# Altium schematic sheet ANA_FE_CLK_SYNTH.SchDoc: My title
size A3; Organization: University of California; Address1: 475 Portola Plaza; Address2: Los Angeles, CA 90095; Revision: R01; SheetNumber: 1; SheetTotal: 1
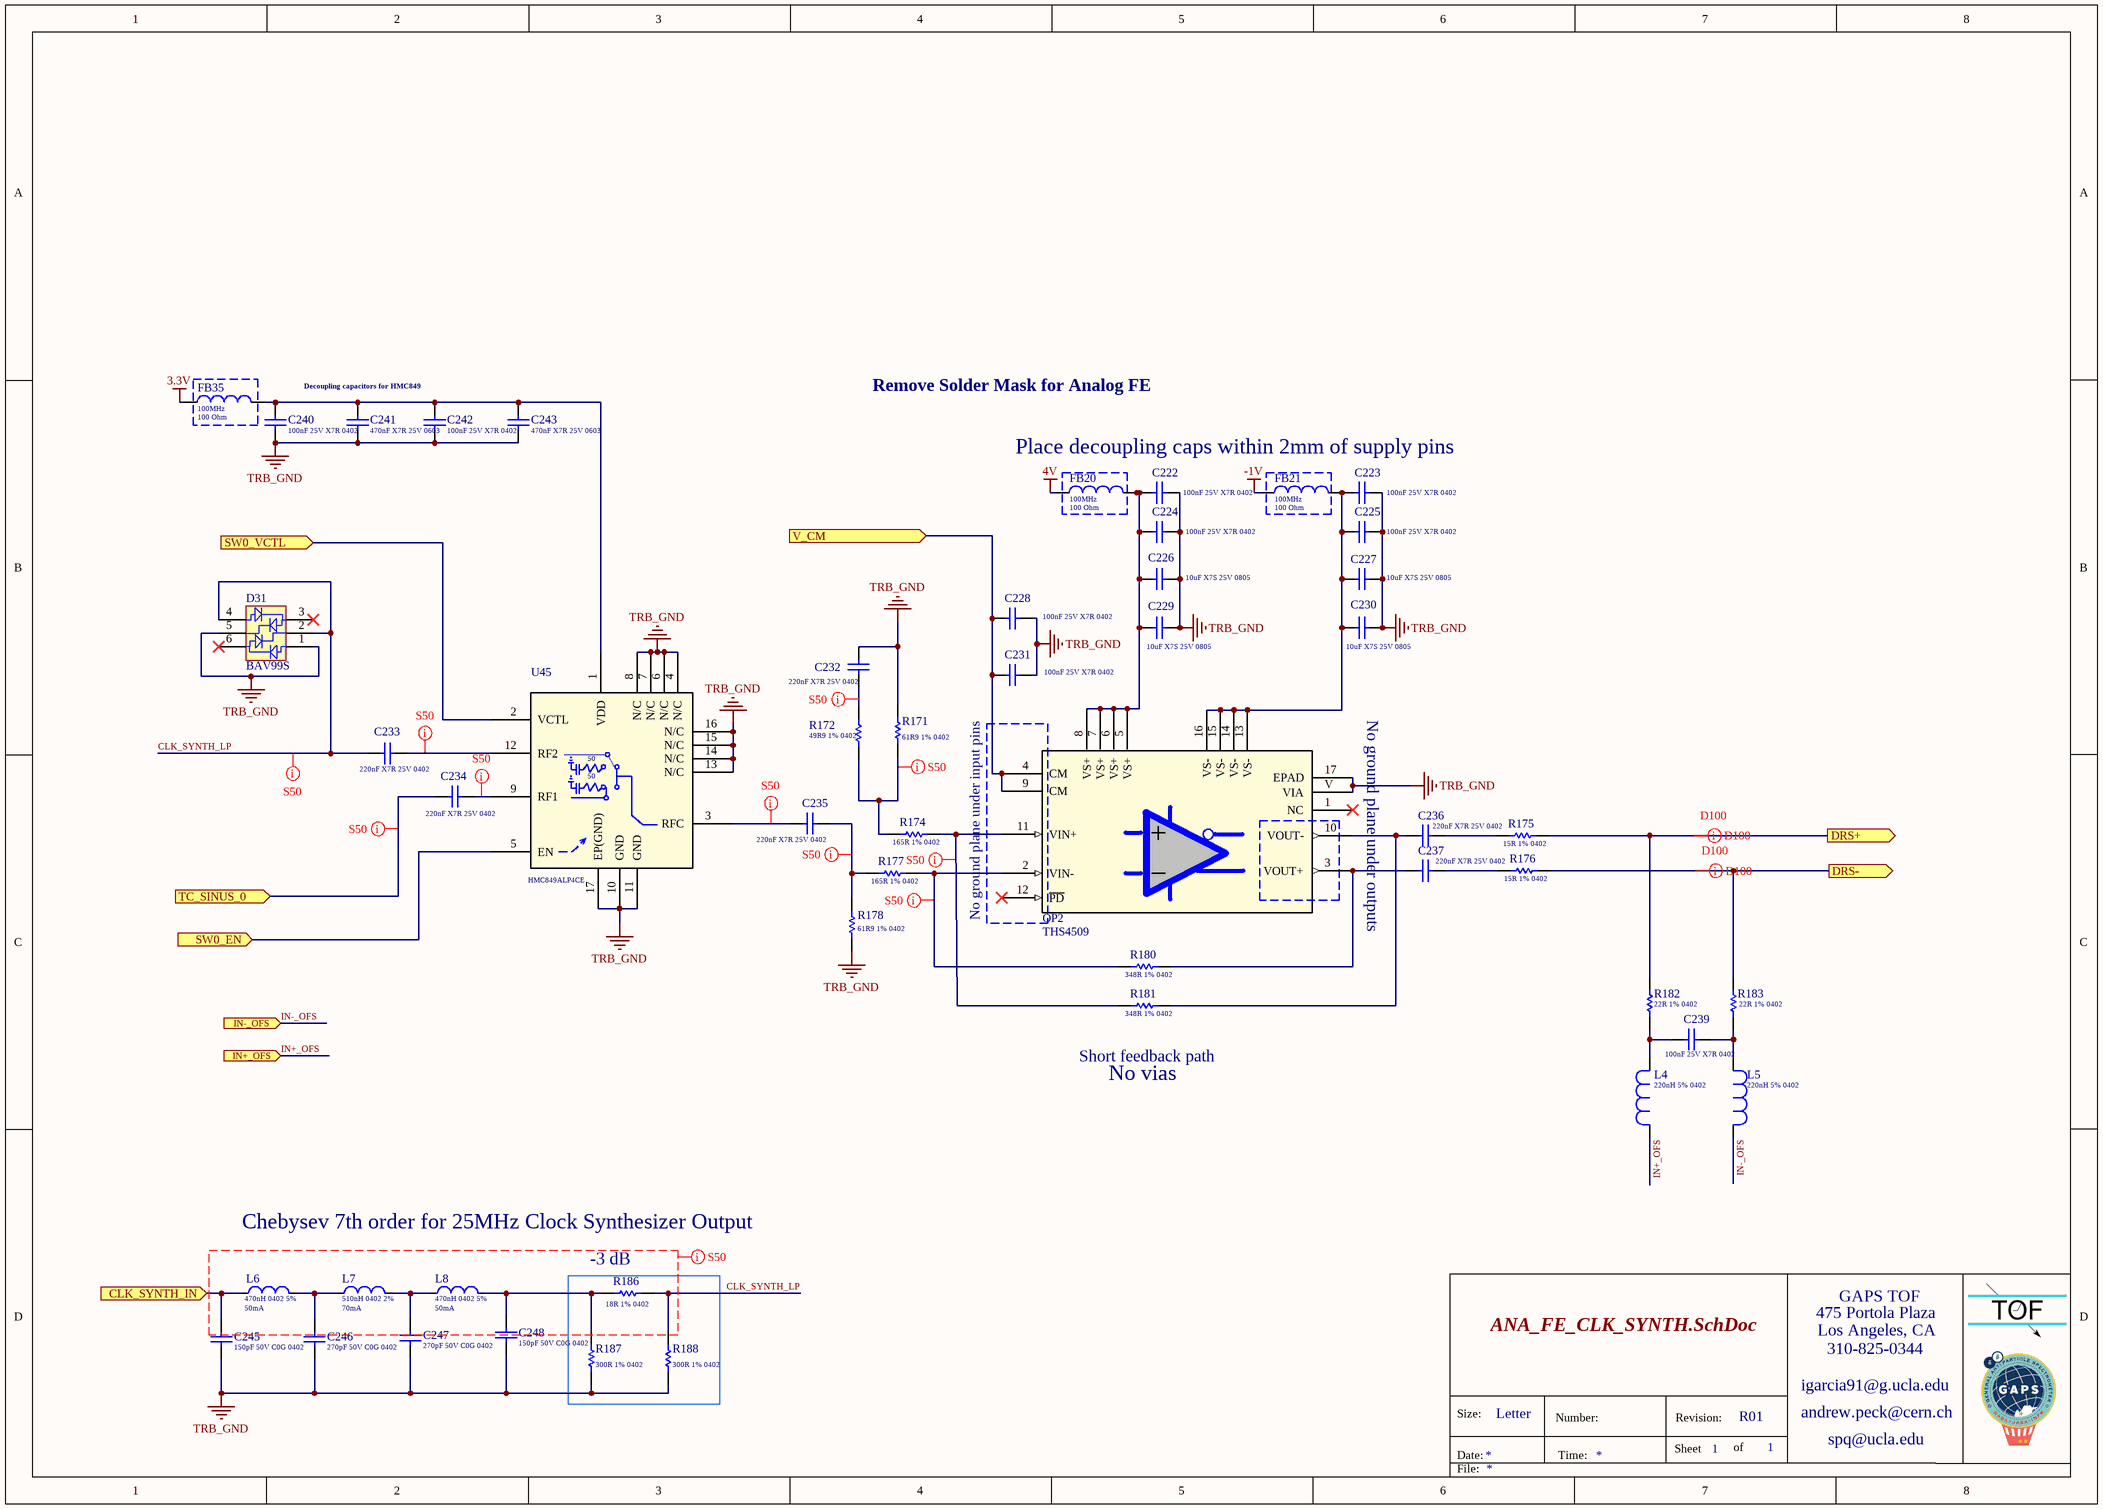
[diagram p0: ANA_FE_CLK_SYNTH.SchDoc]

## Parts
C222  Capacitance: 100nF 25V X7R 0402  [Cap_Taiyo_Yuden_TMK105B7104KV-FR_100nF]  (hidden comment: Cap_Taiyo_Yuden_TMK105B7104KV-FR_100nF)
C223  Capacitance: 100nF 25V X7R 0402  [Cap_Taiyo_Yuden_TMK105B7104KV-FR_100nF]  (hidden comment: Cap_Taiyo_Yuden_TMK105B7104KV-FR_100nF)
C224  Capacitance: 100nF 25V X7R 0402  [Cap_Taiyo_Yuden_TMK105B7104KV-FR_100nF]  (hidden comment: Cap_Taiyo_Yuden_TMK105B7104KV-FR_100nF)
C225  Capacitance: 100nF 25V X7R 0402  [Cap_Taiyo_Yuden_TMK105B7104KV-FR_100nF]  (hidden comment: Cap_Taiyo_Yuden_TMK105B7104KV-FR_100nF)
C226  Capacitance: 10uF X7S 25V 0805  [Cap_Murata_ GRM21BC71E106ME11L_10uF]  (hidden comment: Cap_Murata_ GRM21BC71E106ME11L_10uF)
C227  Capacitance: 10uF X7S 25V 0805  [Cap_Murata_ GRM21BC71E106ME11L_10uF]  (hidden comment: Cap_Murata_ GRM21BC71E106ME11L_10uF)
C228  Capacitance: 100nF 25V X7R 0402  [Cap_Taiyo_Yuden_TMK105B7104KV-FR_100nF]  (hidden comment: Cap_Taiyo_Yuden_TMK105B7104KV-FR_100nF)
C229  Capacitance: 10uF X7S 25V 0805  [Cap_Murata_ GRM21BC71E106ME11L_10uF]  (hidden comment: Cap_Murata_ GRM21BC71E106ME11L_10uF)
C230  Capacitance: 10uF X7S 25V 0805  [Cap_Murata_ GRM21BC71E106ME11L_10uF]  (hidden comment: Cap_Murata_ GRM21BC71E106ME11L_10uF)
C231  Capacitance: 100nF 25V X7R 0402  [Cap_Taiyo_Yuden_TMK105B7104KV-FR_100nF]  (hidden comment: Cap_Taiyo_Yuden_TMK105B7104KV-FR_100nF)
C232  Capacitance: 220nF X7R 25V 0402  [Cap_TDK_C1608X5R1A106M080AC_220nF]  (hidden comment: Cap_TDK_C1608X5R1A106M080AC_220nF)
C233  Capacitance: 220nF X7R 25V 0402  [Cap_TDK_C1608X5R1A106M080AC_220nF]  (hidden comment: Cap_TDK_C1608X5R1A106M080AC_220nF)
C234  Capacitance: 220nF X7R 25V 0402  [Cap_TDK_C1608X5R1A106M080AC_220nF]  (hidden comment: Cap_TDK_C1608X5R1A106M080AC_220nF)
C235  Capacitance: 220nF X7R 25V 0402  [Cap_TDK_C1608X5R1A106M080AC_220nF]  (hidden comment: Cap_TDK_C1608X5R1A106M080AC_220nF)
C236  Capacitance: 220nF X7R 25V 0402  [Cap_TDK_C1608X5R1A106M080AC_220nF]  (hidden comment: Cap_TDK_C1608X5R1A106M080AC_220nF)
C237  Capacitance: 220nF X7R 25V 0402  [Cap_TDK_C1608X5R1A106M080AC_220nF]  (hidden comment: Cap_TDK_C1608X5R1A106M080AC_220nF)
C239  Capacitance: 100nF 25V X7R 0402  [Cap_Taiyo_Yuden_TMK105B7104KV-FR_100nF]  (hidden comment: Cap_Taiyo_Yuden_TMK105B7104KV-FR_100nF)
C240  Capacitance: 100nF 25V X7R 0402  [Cap_Taiyo_Yuden_TMK105B7104KV-FR_100nF]  (hidden comment: Cap_Taiyo_Yuden_TMK105B7104KV-FR_100nF)
C241  Capacitance: 470nF X7R 25V 0603  [Cap_Wurth_Electronics_885012206075_470nF]  (hidden comment: Cap_Wurth_Electronics_885012206075_470nF)
C242  Capacitance: 100nF 25V X7R 0402  [Cap_Taiyo_Yuden_TMK105B7104KV-FR_100nF]  (hidden comment: Cap_Taiyo_Yuden_TMK105B7104KV-FR_100nF)
C243  Capacitance: 470nF X7R 25V 0603  [Cap_Wurth_Electronics_885012206075_470nF]  (hidden comment: Cap_Wurth_Electronics_885012206075_470nF)
C245  Capacitance: 150pF 50V C0G 0402  [Cap_TDK_CGA2B2C0G2A151J050BE_150pF]  (hidden comment: Cap_TDK_CGA2B2C0G2A151J050BE_150pF)
C246  Capacitance: 270pF 50V C0G 0402  [Cap_Murata_GCM1555C1H271FA16D_270pF]  (hidden comment: Cap_Murata_GCM1555C1H271FA16D_270pF)
C247  Capacitance: 270pF 50V C0G 0402  [Cap_Murata_GCM1555C1H271FA16D_270pF]  (hidden comment: Cap_Murata_GCM1555C1H271FA16D_270pF)
C248  Capacitance: 150pF 50V C0G 0402  [Cap_TDK_CGA2B2C0G2A151J050BE_150pF]  (hidden comment: Cap_TDK_CGA2B2C0G2A151J050BE_150pF)
D31  BAV99S  [INF-SOT363_V]
FB20  Measuring Frequency: 100MHz  Impedance: 100 Ohm  [FB_Wurth_Electronics_742792731_100Ohms]  (hidden comment: 742792731)
FB21  Measuring Frequency: 100MHz  Impedance: 100 Ohm  [FB_Wurth_Electronics_742792731_100Ohms]  (hidden comment: 742792731)
FB35  Measuring Frequency: 100MHz  Impedance: 100 Ohm  [FB_Wurth_Electronics_742792731_100Ohms]  (hidden comment: 742792731)
L4  Inductance: 220nH 5% 0402  [Ind_TDK_ MLG1005SR22JT000_220nH]  (hidden comment: Ind_TDK_ MLG1005SR22JT000_220nH)
L5  Inductance: 220nH 5% 0402  [Ind_TDK_ MLG1005SR22JT000_220nH]  (hidden comment: Ind_TDK_ MLG1005SR22JT000_220nH)
L6  470nH 0402 5%  Current Rating: 50mA  [TDK_MLF1005GR47JT000_0]
L7  510nH 0402 2%  Current Rating: 70mA  [TDK_MHQ1005PR51GT000_0]
L8  470nH 0402 5%  Current Rating: 50mA  [TDK_MLF1005GR47JT000_0]
OP2  THS4509  [RGT16]
R171  61R9 1% 0402  [RESC0402(1005)_L]
R172  49R9 1% 0402  [RESC0402(1005)_L]
R174  165R 1% 0402  [RESC0402(1005)_L]
R175  15R 1% 0402  [RESC0402(1005)_L]
R176  15R 1% 0402  [RESC0402(1005)_L]
R177  165R 1% 0402  [RESC0402(1005)_L]
R178  61R9 1% 0402  [RESC0402(1005)_L]
R180  348R 1% 0402  [RESC0402(1005)_L]
R181  348R 1% 0402  [RESC0402(1005)_L]
R182  22R 1% 0402  [RESC0402(1005)_L]
R183  22R 1% 0402  [RESC0402(1005)_L]
R186  18R 1% 0402  [RESC0402(1005)_L]
R187  300R 1% 0402  [RESC0402(1005)_L]
R188  300R 1% 0402  [RESC0402(1005)_L]
U45  HMC849  [CP_16_40]  (value not drawn)

## Blocks framed on the sheet
-3 dB: R186-R188

## Ports
CLK_SYNTH_IN (in), DRS+ (out), DRS- (out), IN+_OFS (in), IN-_OFS (in), SW0_EN (in), SW0_VCTL (in), TC_SINUS_0 (in), V_CM (in)

## Nets
3.3V: FB35.1
4V: FB20.1
-1V: FB21.1
TRB_GND: C222.2 C223.2 C224.2 C225.2 C226.1 C227.1 C228.2 C229.1 C230.1 C231.2 C232.1 C240.1 C241.2 C242.1 C243.2 C245.1 C246.1 C247.1 C248.1 D31.1(A1) D31.5(K5) OP2.17(EPAD) OP2.V(VIA) R171.2 R178.1 R187.1 R188.1 U45.4(N/C) U45.6(N/C) U45.7(N/C) U45.8(N/C) U45.10(GND) U45.11(GND) U45.13(N/C) U45.14(N/C) U45.15(N/C) U45.16(N/C) U45.17(EP(GND))
CLK_SYNTH_IN: C245.2 L6.1 ; port CLK_SYNTH_IN
CLK_SYNTH_LP: C233.2 D31.2(K2) D31.4(A4) R186.2 R188.2
DRS+: R175.2 R182.2 ; port DRS+
DRS-: R176.2 R183.2 ; port DRS-
IN+_OFS: L4.2 ; port IN+_OFS
IN-_OFS: L5.1 ; port IN-_OFS
SW0_EN: U45.5(EN) ; port SW0_EN
SW0_VCTL: U45.2(VCTL) ; port SW0_VCTL
TC_SINUS_0: C234.2 ; port TC_SINUS_0
V_CM: C228.1 C231.1 OP2.4(CM) OP2.9(CM) ; port V_CM
NetC222_1: C222.1 C224.1 C226.2 C229.2 FB20.2 OP2.5(VS+) OP2.6(VS+) OP2.7(VS+) OP2.8(VS+)
NetC223_1: C223.1 C225.1 C227.2 C230.2 FB21.2 OP2.13(VS-) OP2.14(VS-) OP2.15(VS-) OP2.16(VS-)
NetC232_2: C232.2 R172.2
NetC233_1: C233.1 U45.12(RF2)
NetC234_1: C234.1 U45.9(RF1)
NetC235_1: C235.1 R177.1 R178.2
NetC235_2: C235.2 U45.3(RFC)
NetC236_1: C236.1 R175.1
NetC236_2: C236.2 OP2.10(VOUT-) R181.2
NetC237_1: C237.1 R176.1
NetC237_2: C237.2 OP2.3(VOUT+) R180.2
NetC239_1: C239.1 L4.1 R182.1
NetC239_2: C239.2 L5.2 R183.1
NetC240_2: C240.2 C241.1 C242.2 C243.1 FB35.2 U45.1(VDD)
NetC246_2: C246.2 L6.2 L7.1
NetC247_2: C247.2 L7.2 L8.1
NetC248_2: C248.2 L8.2 R186.1 R187.2
NetOP2_2: OP2.2(VIN-) R177.2 R180.1
NetOP2_11: OP2.11(VIN+) R174.2 R181.1
NetR171_1: R171.1 R172.1 R174.1

Not connected (* = marked no-connect by the designer): D31 3(C3)* 6(C6)*; OP2 1(NC)* 12(~{PD})*

## Layout directives
net class S50: (no net found under the mark), CLK_SYNTH_LP, NetC232_2, NetC233_1, NetC234_1, NetC235_1, NetC235_2, NetOP2_2, NetOP2_11, NetR171_1, TC_SINUS_0
differential pair; differential pair class D100: DRS+, DRS-

## Notes on the sheet
- Decoupling capacitors for HMC849
- Remove Solder Mask for Analog FE
- Place decoupling caps within 2mm of supply pins
- No ground plane under outputs
- D100
- No ground plane under input pins
- (near R181) Short feedback path
- No vias
- Chebysev 7th order for 25MHz Clock Synthesizer Output
- 475 Portola Plaza
- GAPS TOF
- igarcia91@g.ucla.edu
- Los Angeles, CA
- 310-825-0344
- Size:
- Date:
- Letter
- Number:
- Time:
- Sheet
- Revision:
- of
- andrew.peck@cern.ch
- spq@ucla.edu
- File:
- (in symbol HMC849ALP4CE) 50

## Library data of the parts
C222-C225 C228 C231 C239 C240 C242 = Cap_Taiyo_Yuden_TMK105B7104KV-FR_100nF: CAP CER 100nF 25V X7R 0402; Supplier 1: Mouser; Supplier Part Number 1: 963-TMK105B7104KV-FR
C226 C227 C229 C230 = Cap_Murata_ GRM21BC71E106ME11L_10uF: CAP CER 10uF 25V X7R 0805; Supplier 1: Mouser; Supplier Part Number 1: 81-GRM21BC71E106ME1L
C232-C237 = Cap_TDK_C1608X5R1A106M080AC_220nF: CAP CER 220nF 50V X7R 0402; Supplier 1: Mouser; Supplier Part Number 1: 810-C1005X7R1E224KBE
C241 C243 = Cap_Wurth_Electronics_885012206075_470nF: CAP CER 470nF 25V X7R 0603; Supplier 1: Mouser; Supplier Part Number 1: 710-885012206075
C245 C248 = Cap_TDK_CGA2B2C0G2A151J050BE_150pF: CAP 150pF 50V C0G ±1% 0402 (1000 Metric) Thickness 1mm SMD; Supplier 1: Mouser; Supplier Part Number 1: 810-CGA2B2C0G2A151J0
C246 C247 = Cap_Murata_GCM1555C1H271FA16D_270pF: CAP 270pF 50V C0G ±1% 0402; Supplier 1: Mouser; Supplier Part Number 1: 81-GCM1555C1H271FA6D
D31 = CMP-1176-00030-1: Silicon Switching Diode, SOT363, Reel, Green; Manufacturer: Infineon; VR (max): 80Â V; VBR (min): 85Â V; IF (max): 200Â mA; trr (max): 4Â ns; Green: TRUE; VF (max): 1.25Â V; Configuration: Quadruple; IR (max): 150Â nA; PackageReference: SOT363; Halogen-free: TRUE; ComponentLink3URL: http://www.infineon.com/dgdl/SOT363-Package_Overview.pdf?folderId=db3a30431936bc4b01195360bd8f3cdc&fileId=db3a30431936bc4b0119536b62bf3cf5; PartNumber: BAV99S; ComponentLink3Description: Package Specification; ComponentLink2URL: http://www.infineon.com/dgdl/bav99series.pdf?folderId=db3a30431400ef6801141b5844e103ea&fileId=db3a30431400ef6801141c1b237d042f; ComponentLink1Description: Manufacturer URL; ComponentLink2Description: Datasheet; ComponentLink1URL: http://www.infineon.com/; PackageDescription: 6-Pin Small Outline Transistor Package, 1.25 x 2 mm Body; Mounting Technology: Surface Mount
FB20 FB21 FB35 = FB_Wurth_Electronics_742792731_100Ohms: FB SMD 100 OHM 25% 1.2A 0402; DC Resistance: 90mOhm; Supplier 1: Mouser; Supplier Part Number 1: 710-742792731
L4 L5 = Ind_TDK_ MLG1005SR22JT000_220nH: Fixed Inductors .22 UH 5%; Supplier 1: Mouser; Supplier Part Number 1: 810-MLG1005SR22JT000
L6 L8 = Ind_TDK_MLF1005GR47JT000: IND 470nH Shielded Multilayer Inductor 50mA 420 mOhm Max 0402 (1005 Metric); Manufacturer: TDK; Value: 270.0nH; DC Resistance (DCR): 420mOhms; Part Number: MLF1005GR47JT000; ComponentLink2Description: Datasheet; Temperature: -55°C to +125°C; ComponentLink2URL: https://product.tdk.com/info/en/catalog/datasheets/inductor_commercial_decoupling_mlz1608_en.pdf; RoHS: TRUE; Temperature Range High: +125°C; Lead Free: yes; Temperature Range Low: -55°C; Tolerance: ±5%; Package: 0402 (1005); Inductance: 470nH; Supplier 1: Mouser; Supplier Part Number 1: 810-MLF1005GR47JT000
L7 = Ind_TDK_MHQ1005PR51GT000: IND 510nH Shielded Multilayer Inductor 70mA 10.2 Ohm Max 0402 (1005 Metric); Manufacturer: TDK; Value: 510.0nH; DC Resistance (DCR): 10.2Ohms; Part Number: MHQ1005PR51GT000; ComponentLink2Description: Datasheet; Temperature: -55°C to +125°C; ComponentLink2URL: https://product.tdk.com/info/en/catalog/datasheets/inductor_commercial_decoupling_mlz1608_en.pdf; RoHS: TRUE; Temperature Range High: +125°C; Lead Free: yes; Temperature Range Low: -55°C; Tolerance: ±2%; Package: 0402 (1005); Inductance: 510nH; Supplier Part Number 1: 810-MHQ1005PR51GT000; Supplier 1: Mouser
OP2 = THS4509RGTT: Imported; Vendor: Texas Instruments; Built_By: EMA_UL_Team; C: Copyright (C) 2015 Accelerated Designs. All rights reserved; Manufacturer_Part_Number: THS4509RGTT; RefDes: RefDes; Type: DEV; Value: Value; Supplier 1: Mouser; Supplier Part Number 1: 595-THS4509RGTT
R171 R178 = CMP-1011-00374-1: 61R9 0.063W 1% 0402 (1005 Metric)  SMD; Value: 61.90 Ohm; Case-EIA: 0402; Case-Metric: 1005; Tolerance: 1 %; Technology: SMT; Power: 0.063 W
R172 = CMP-1011-00363-1: 49R9 0.063W 1% 0402 (1005 Metric)  SMD; Case-EIA: 0402; Case-Metric: 1005; Value: 49.90 Ohm; Power: 0.063 W; Technology: SMT; Tolerance: 1 %
R174 R177 = CMP-1011-00420-1: 165R 0.063W 1% 0402 (1005 Metric)  SMD; Case-EIA: 0402; Case-Metric: 1005; Value: 165.00 Ohm; Power: 0.063 W; Technology: SMT; Tolerance: 1 %
R175 R176 = CMP-1011-00302-1: 15R 0.063W 1% 0402 (1005 Metric)  SMD; Case-Metric: 1005; Case-EIA: 0402; Value: 15.00 Ohm; Tolerance: 1 %; Power: 0.063 W; Technology: SMT
R180 R181 = CMP-1011-00457-1: 348R 0.063W 1% 0402 (1005 Metric)  SMD; Case-EIA: 0402; Value: 348.00 Ohm; Case-Metric: 1005; Tolerance: 1 %; Technology: SMT; Power: 0.063 W
R182 R183 = CMP-1011-00320-1: 22R 0.063W 1% 0402 (1005 Metric)  SMD; Case-EIA: 0402; Case-Metric: 1005; Value: 22.00 Ohm; Tolerance: 1 %; Technology: SMT; Power: 0.063 W
R186 = CMP-1011-00311-1: 18R 0.063W 1% 0402 (1005 Metric)  SMD; Case-EIA: 0402; Value: 18.00 Ohm; Case-Metric: 1005; Tolerance: 1 %; Power: 0.063 W; Technology: SMT
R187 R188 = CMP-1011-00449-1: 300R 0.063W 1% 0402 (1005 Metric)  SMD; Case-EIA: 0402; Value: 300.00 Ohm; Case-Metric: 1005; Tolerance: 1 %; Technology: SMT; Power: 0.063 W
U45 = HMC849ALP4CE: RF Switch ICs DC-6 GHZ Hi Isolation Switch; Vendor: Analog Devices Inc; Built_By: Analog Devices Imc.; Manufacturer_Part_Number: HMC849ALP4CE; RefDes: RefDes; Type: DEV; Supplier 1: Mouser; Supplier Part Number 1: 584-HMC849ALP4CE; Series: HMC849ALP4CE